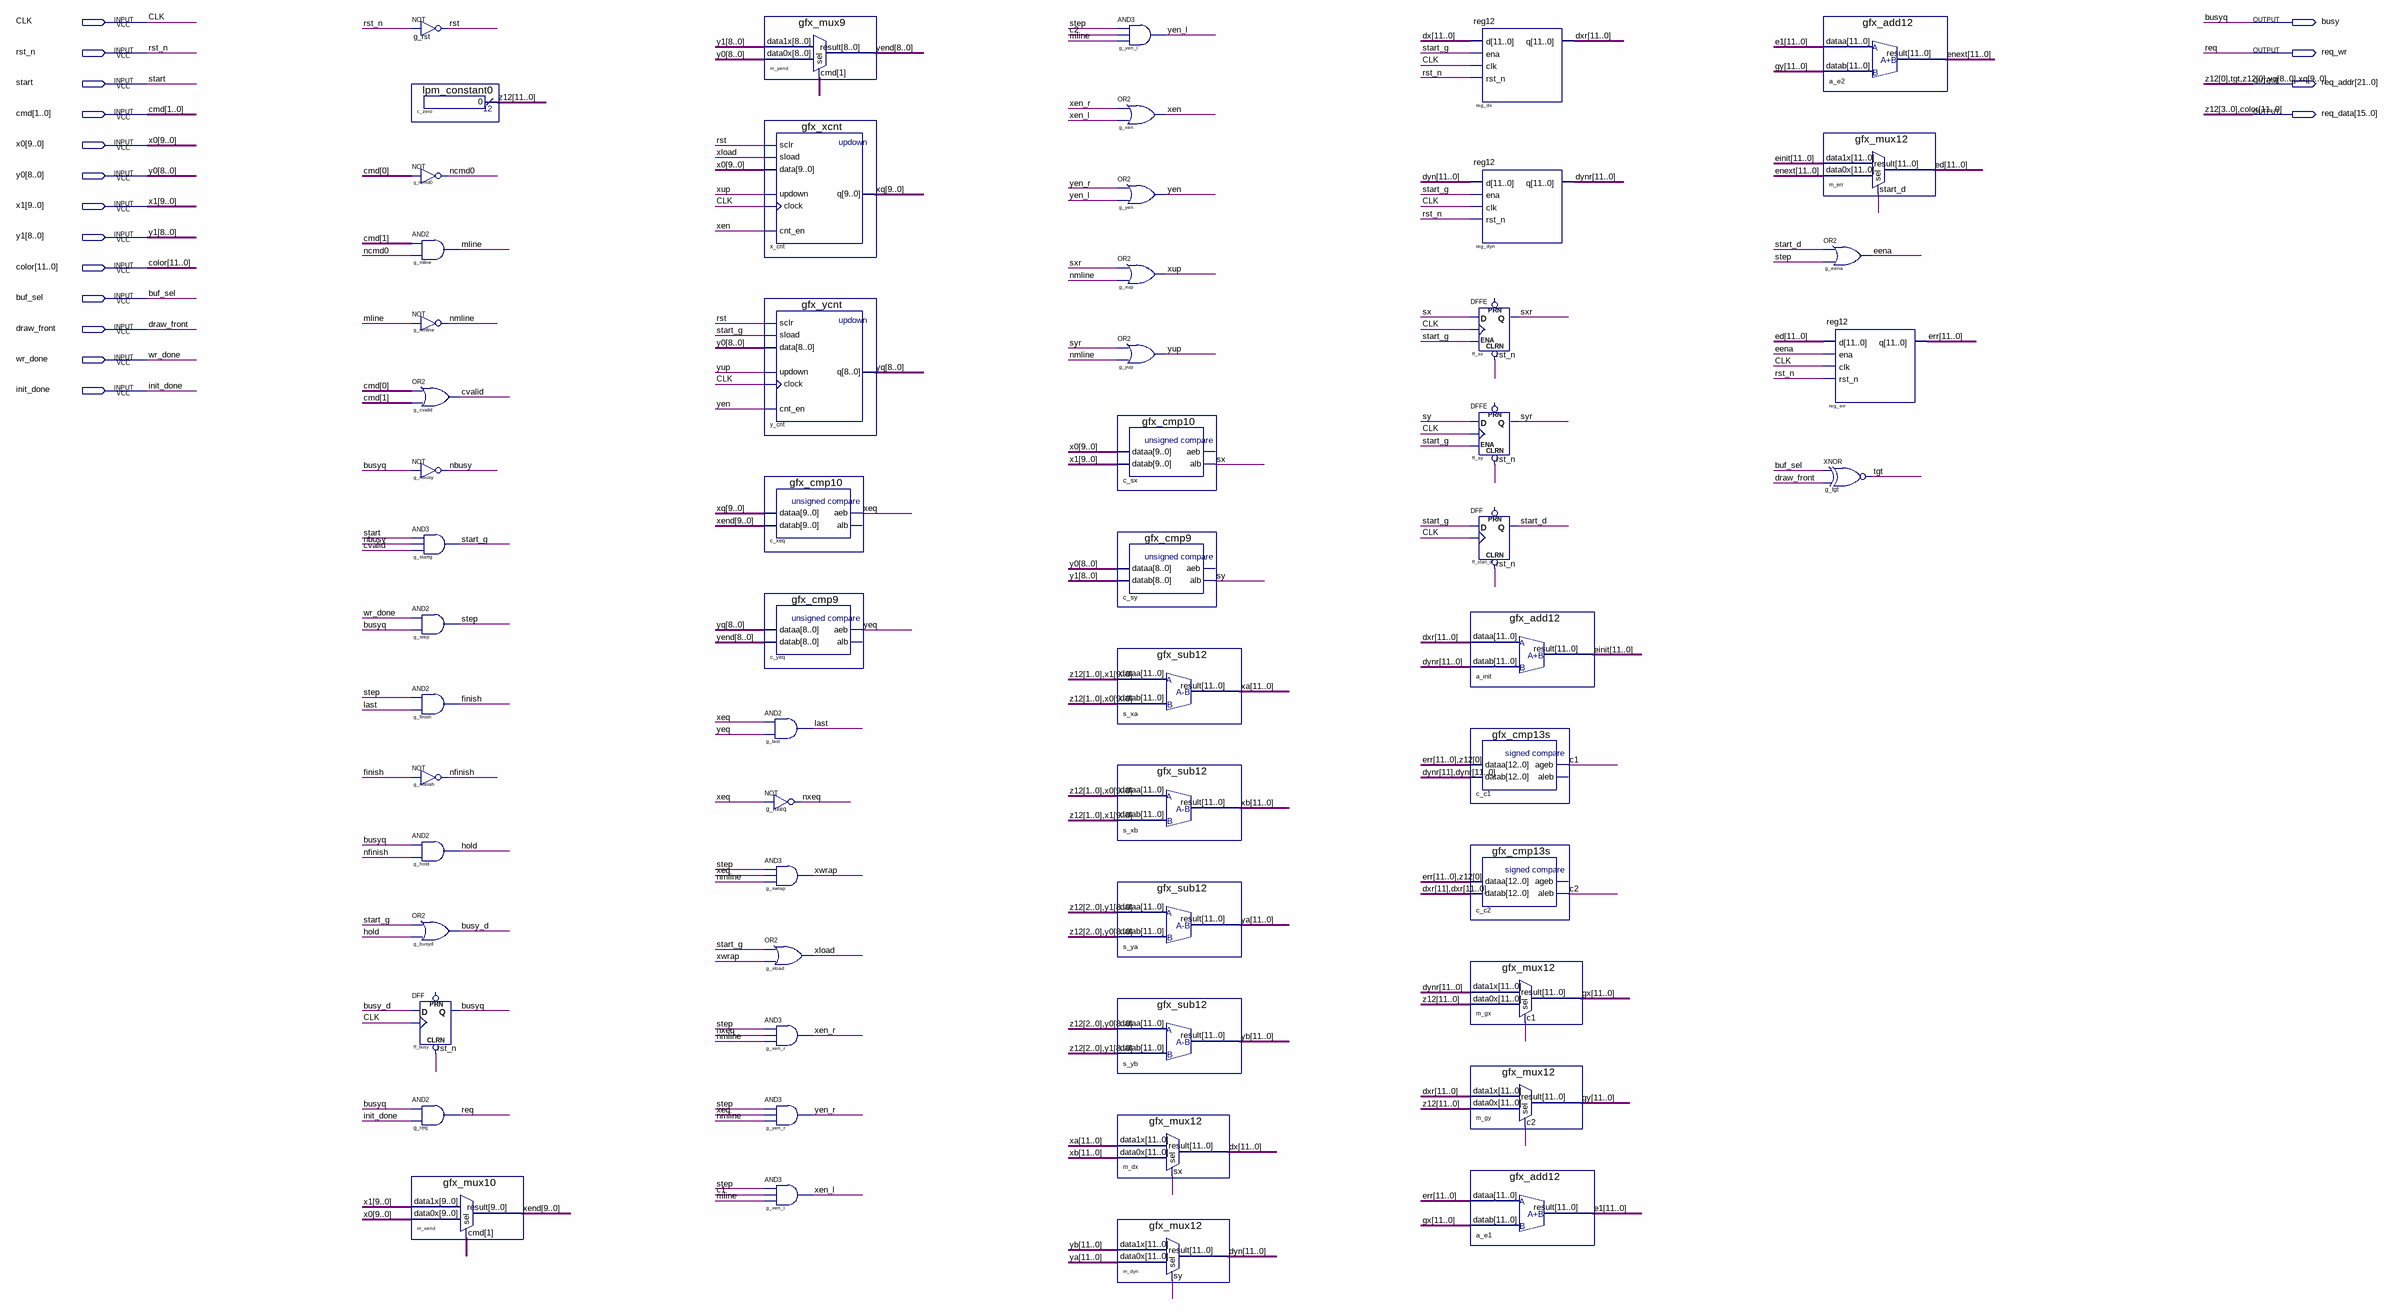
[diagram p0: schematic sheet]
// Quartus schematic gfx_engine.bdf as structural Verilog: 57 symbols, 17 pins
module gfx_engine (
  input  CLK,
  input  rst_n,
  input  start,
  input  [1:0] cmd,
  input  [9:0] x0,
  input  [8:0] y0,
  input  [9:0] x1,
  input  [8:0] y1,
  input  [11:0] color,
  input  buf_sel,
  input  draw_front,
  input  wr_done,
  input  init_done,
  output busy,
  output req_wr,
  output [21:0] req_addr,
  output [15:0] req_data
);

  wire busy_d, c1, c2, cvalid, eena, finish, hold, last, mline, nbusy, ncmd0, nfinish, nmline, nxeq, rst,
       start_d, start_g, step, sx, sxr, sy, syr, xen, xen_l, xen_r, xeq, xload, xup, xwrap, yen, yen_l,
       yen_r, yeq, yup;
  wire [8:0] yend;
  wire [9:0] xend;
  wire [11:0] dx, dxr, dyn, dynr, e1, ed, einit, enext, err, gx, gy, xa, xb, ya, yb;
  wire [11:4] z12;

  not g_rst (rst, rst_n);
  lpm_constant0 c_zero (.result({z12, req_data[15:13], req_addr[21]}));
  not g_ncmd0 (ncmd0, cmd[0]);
  and g_mline (mline, cmd[1], ncmd0);
  not g_nmline (nmline, mline);
  or g_cvalid (cvalid, cmd[0], cmd[1]);
  not g_nbusy (nbusy, busy);
  and g_startg (start_g, start, nbusy, cvalid);
  and g_step (step, wr_done, busy);
  and g_finish (finish, step, last);
  not g_nfinish (nfinish, finish);
  and g_hold (hold, busy, nfinish);
  or g_busyd (busy_d, start_g, hold);
  DFF ff_busy (.CLRN(rst_n), .CLK(CLK), .D(busy_d), .Q(busy));  // open: PRN
  and g_req (req_wr, busy, init_done);
  gfx_mux10 m_xend (.data1x(x1), .data0x(x0), .sel(cmd[1]), .result(xend));
  gfx_mux9 m_yend (.data1x(y1), .data0x(y0), .sel(cmd[1]), .result(yend));
  gfx_xcnt x_cnt (.sclr(rst), .sload(xload), .data(x0), .updown(xup), .clock(CLK), .cnt_en(xen), .q(req_addr[9:0]));
  gfx_ycnt y_cnt (.sclr(rst), .sload(start_g), .data(y0), .updown(yup), .clock(CLK), .cnt_en(yen), .q(req_addr[18:10]));
  gfx_cmp10 c_xeq (.dataa(req_addr[9:0]), .datab(xend), .aeb(xeq));  // open: alb
  gfx_cmp9 c_yeq (.dataa(req_addr[18:10]), .datab(yend), .aeb(yeq));  // open: alb
  and g_last (last, xeq, yeq);
  not g_nxeq (nxeq, xeq);
  and g_xwrap (xwrap, step, xeq, nmline);
  or g_xload (xload, start_g, xwrap);
  and g_xen_r (xen_r, step, nxeq, nmline);
  and g_yen_r (yen_r, step, xeq, nmline);
  and g_xen_l (xen_l, step, c1, mline);
  and g_yen_l (yen_l, step, c2, mline);
  or g_xen (xen, xen_r, xen_l);
  or g_yen (yen, yen_r, yen_l);
  or g_xup (xup, sxr, nmline);
  or g_yup (yup, syr, nmline);
  gfx_cmp10 c_sx (.dataa(x0), .datab(x1), .alb(sx));  // open: aeb
  gfx_cmp9 c_sy (.dataa(y0), .datab(y1), .alb(sy));  // open: aeb
  gfx_sub12 s_xa (.dataa({req_data[13], req_addr[21], x1}), .datab({req_data[13], req_addr[21], x0}), .result(xa));
  gfx_sub12 s_xb (.dataa({req_data[13], req_addr[21], x0}), .datab({req_data[13], req_addr[21], x1}), .result(xb));
  gfx_sub12 s_ya (
    .dataa({req_data[14:13], req_addr[21], y1}), .datab({req_data[14:13], req_addr[21], y0}), .result(ya));
  gfx_sub12 s_yb (
    .dataa({req_data[14:13], req_addr[21], y0}), .datab({req_data[14:13], req_addr[21], y1}), .result(yb));
  gfx_mux12 m_dx (.data1x(xa), .data0x(xb), .sel(sx), .result(dx));
  gfx_mux12 m_dyn (.data1x(yb), .data0x(ya), .sel(sy), .result(dyn));
  reg12 reg_dx (.d(dx), .ena(start_g), .clk(CLK), .rst_n(rst_n), .q(dxr));
  reg12 reg_dyn (.d(dyn), .ena(start_g), .clk(CLK), .rst_n(rst_n), .q(dynr));
  DFFE ff_sx (.CLRN(rst_n), .D(sx), .CLK(CLK), .ENA(start_g), .Q(sxr));  // open: PRN
  DFFE ff_sy (.CLRN(rst_n), .D(sy), .CLK(CLK), .ENA(start_g), .Q(syr));  // open: PRN
  DFF ff_start_d (.CLRN(rst_n), .CLK(CLK), .D(start_g), .Q(start_d));  // open: PRN
  gfx_add12 a_init (.dataa(dxr), .datab(dynr), .result(einit));
  gfx_cmp13s c_c1 (.dataa({err, req_addr[21]}), .datab({{2{dynr[11]}}, dynr[10:0]}), .ageb(c1));  // open: aleb
  gfx_cmp13s c_c2 (.dataa({err, req_addr[21]}), .datab({{2{dxr[11]}}, dxr[10:0]}), .aleb(c2));  // open: ageb
  gfx_mux12 m_gx (.data1x(dynr), .data0x({z12, req_data[15:13], req_addr[21]}), .sel(c1), .result(gx));
  gfx_mux12 m_gy (.data1x(dxr), .data0x({z12, req_data[15:13], req_addr[21]}), .sel(c2), .result(gy));
  gfx_add12 a_e1 (.dataa(err), .datab(gx), .result(e1));
  gfx_add12 a_e2 (.dataa(e1), .datab(gy), .result(enext));
  gfx_mux12 m_err (.data1x(einit), .data0x(enext), .sel(start_d), .result(ed));
  or g_eena (eena, start_d, step);
  reg12 reg_err (.d(ed), .ena(eena), .clk(CLK), .rst_n(rst_n), .q(err));
  xnor g_tgt (req_addr[20], buf_sel, draw_front);

  assign req_addr[19] = req_addr[21];
  assign req_data[12:0] = {req_addr[21], color};

  // Other names for the same wires on the sheet: busyq = busy; req = req_wr; tgt = req_addr[20];
  //   xq[9:0] = req_addr[9:0]; yq[8:0] = req_addr[18:10]; z12[3:0] = {req_data[15:13], req_addr[21]}
endmodule
